# EAGLE design blinkLED (EAGLE 5.11)
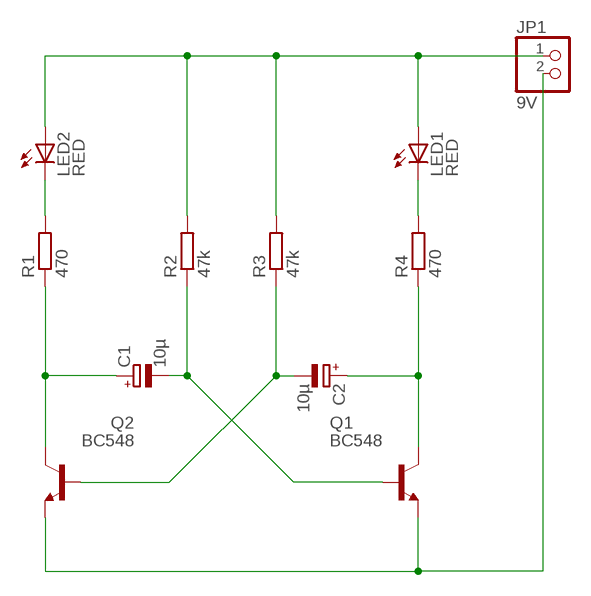
[diagram p0: schematic, sheet 1]

## Parts
C1  10µ  CPOL-EUE2,5-6E  [E2,5-6E]
C2  10µ  CPOL-EUE2,5-6E  [E2,5-6E]
JP1  9V  PINHD-1X2  [1X02]
LED1  RED  LED5MM  [LED5MM]
LED2  RED  LED5MM  [LED5MM]
Q1  BC548  [TO92-EBC]
Q2  BC548  [TO92-EBC]
R1  470  R-EU_0204/5  [0204/5]
R2  47k  R-EU_0204/5  [0204/5]
R3  47k  R-EU_0204/5  [0204/5]
R4  470  R-EU_0204/5  [0204/5]

## Nets
N$1: C2.- Q2.B R3.1
N$2: C1.- Q1.B R2.1
N$3: JP1.2 Q1.E Q2.E
N$4: C1.+ Q2.C R1.1
N$6: C2.+ Q1.C R4.1
N$7: LED2.K(C) R1.2
N$8: LED1.K(C) R4.2
N$10: JP1.1 LED1.A LED2.A R2.2 R3.2

## Library data of the parts
C1 C2 = resistor:CPOL-EU: POLARIZED CAPACITOR, European symbol
JP1 = pinhead:PINHD-1X2: PIN HEADER
LED1 LED2 = led:LED: LED OSRAM: - CHIPLED LG R971, LG N971, LY N971, LG Q971, LY Q971, LO R971, LY R971 LH N974, LH R974 LS Q976, LO Q976, LY Q976 LO Q996 - Hyper CHIPLED LW Q18S LB Q993, LB Q99A, LB R99A - SideLED LS A670, LO A670, LY A670, LG A670, LP A670 LB A673, LV A673, LT A673, LW A673 LH A674 LY A675 LS A676, LA A676, LO A676, LY A676, LW A676 LS A679, LY A679, LG A679 - Hyper Micro SIDELED® LS Y876, LA Y876, LO Y876, LY Y876 LT Y87S - SmartLED LW L88C, LW L88S LB L89C, LB L89S, LG L890 LS L89K, LO L89K, LY L89K LS L896, LA L896, LO L896, LY L896 - TOPLED LS T670, LO T670, LY T670, LG T670, LP T670 LSG T670, LSP T670, LSY T670, LOP T670, LYG T670 LG T671, LOG T671, LSG T671 LB T673, LV T673, LT T673, LW T673 LH T674 LS T676, LA T676, LO T676, LY T676, LB T676, LH T676, LSB T676, LW T676 LB T67C, LV T67C, LT T67C, LS T67K, LO T67K, LY T67K, LW E67C LS E67B, LA E67B, LO E67B, LY E67B, LB E67C, LV E67C, LT E67C LW T67C LS T679, LY T679, LG T679 LS T770, LO T770, LY T770, LG T770, LP T770 LB T773, LV T773, LT T773, LW T773 LH T774 LS E675, LA E675, LY E675, LS T675 LS T776, LA T776, LO T776, LY T776, LB T776 LHGB T686 LT T68C, LB T68C - Hyper Mini TOPLED® LB M676 - Mini TOPLED Santana® LG M470 LS M47K, LO M47K, LY M47K Source: http://www.osram.convergy.de LUXEON: - LUMILED® LXK2-PW12-R00, LXK2-PW12-S00, LXK2-PW14-U00, LXK2-PW14-V00 LXK2-PM12-R00, LXK2-PM12-S00, LXK2-PM14-U00 LXK2-PE12-Q00, LXK2-PE12-R00, LXK2-PE12-S00, LXK2-PE14-T00, LXK2-PE14-U00 LXK2-PB12-K00, LXK2-PB12-L00, LXK2-PB12-M00, LXK2-PB14-N00, LXK2-PB14-P00, LXK2-PB14-Q00 LXK2-PR12-L00, LXK2-PR12-M00, LXK2-PR14-Q00, LXK2-PR14-R00 LXK2-PD12-Q00, LXK2-PD12-R00, LXK2-PD12-S00 LXK2-PH12-R00, LXK2-PH12-S00 LXK2-PL12-P00, LXK2-PL12-Q00, LXK2-PL12-R00 Source: www.luxeon.com KINGBRIGHT: KA-3528ASYC Source: www.kingbright.com
Q1 Q2 = transistor-npn:BC548*: NPN Transistor
R1-R4 = resistor:R-EU_: RESISTOR, European symbol

## Board
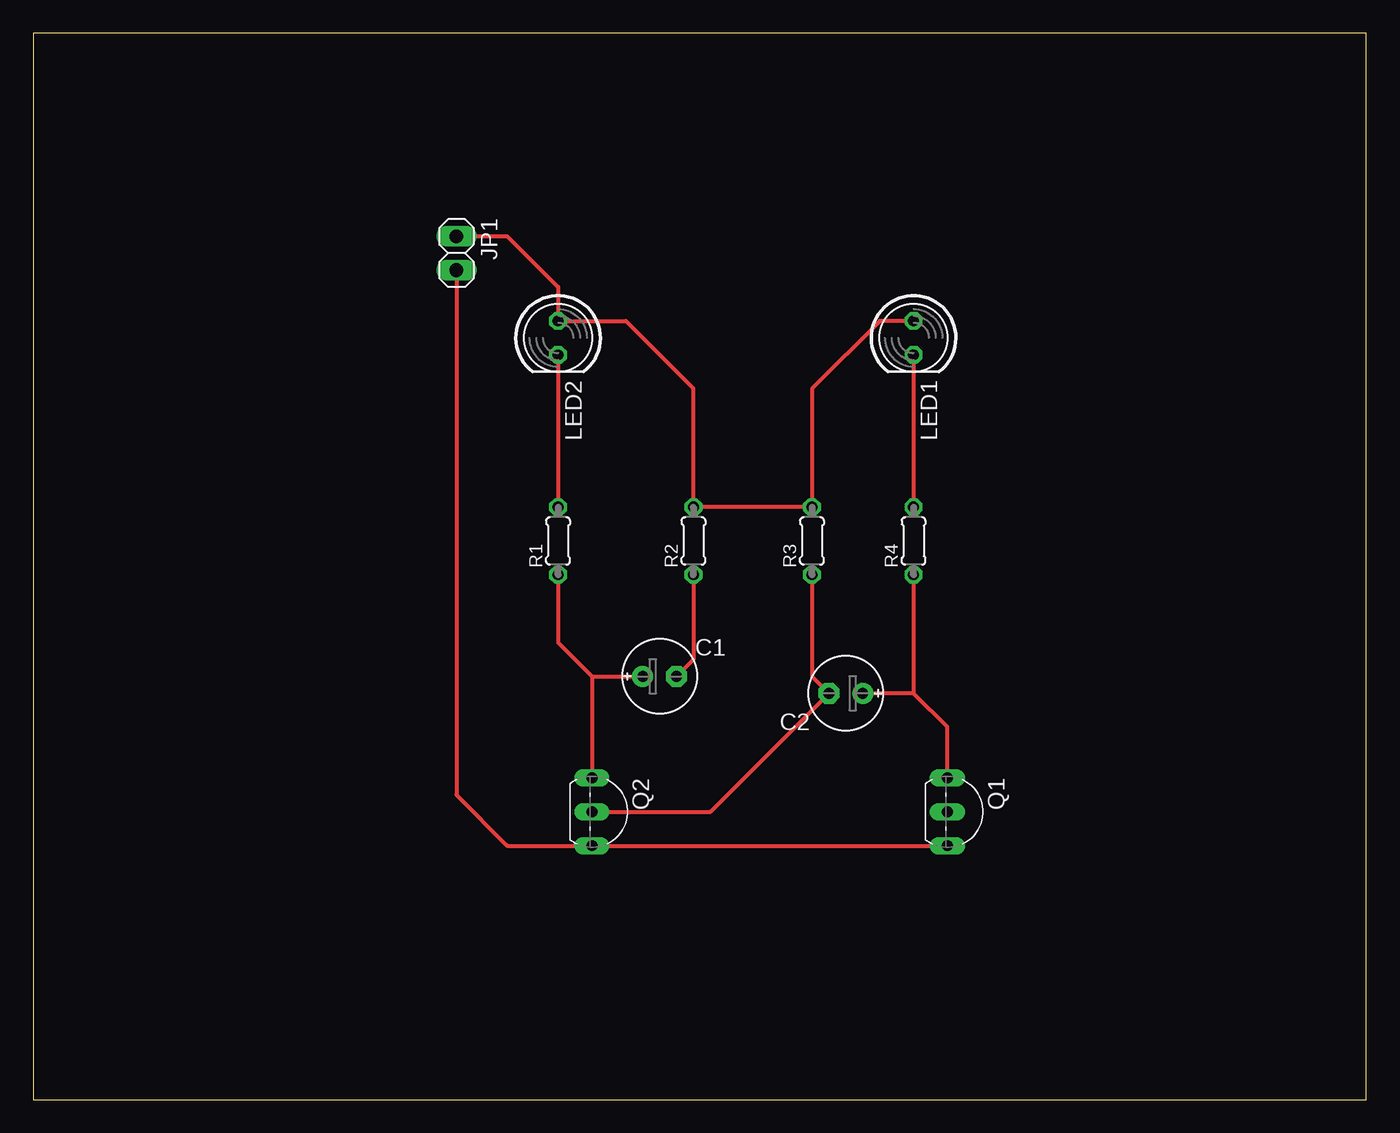
[diagram p1: board, top side]
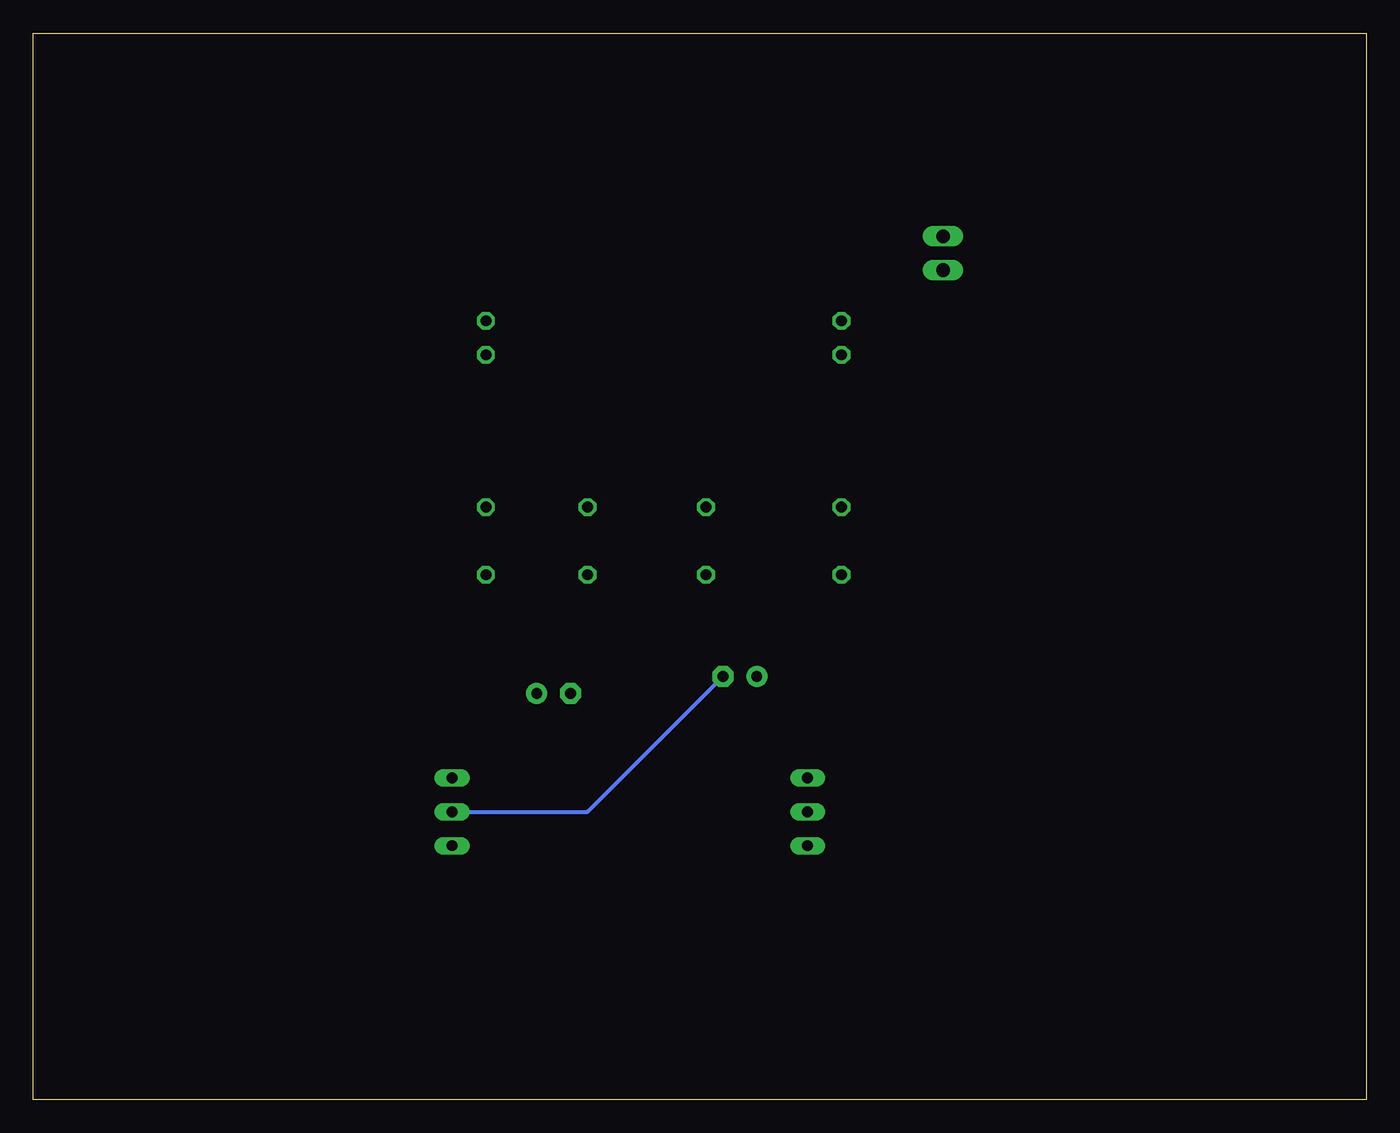
[diagram p2: board, bottom side, seen from below]

Size 100 x 80 mm. Coordinates in mm from the lower left corner, seen from the top.
Outline: 0,0 100,0 100,80 0,80 0,0
Copper layers (1*16): Top 0.035mm / dielectric 1.5mm / Bottom 0.035mm
Design rules "default": minimum track width 6mil, minimum drill 0.35mm, track to track 6mil, track to pad 6mil, pad to pad 6mil, via to via 6mil, smd to smd 6mil, copper to edge 40mil, drill to drill 6mil, minimum pad ring 10mil, minimum via ring 8mil, stop-mask expansion 4mil, vias tented up to drill 0mil, thermal gap 10mil

### Footprints (pad centres in the part's own frame; a part is rotated, then mirrored left to right if it is on the bottom)
E2,5-6E = drill 0.813 pad 1.575: + -1.27,0 | drill 0.813 pad 1.575 octagon: - 1.27,0
1X02 = drill 1.016 long: 1 -1.27,0; 2 1.27,0
LED5MM = drill 0.813 octagon: A -1.27,0; K 1.27,0
TO92-EBC = drill 0.813 long: B 0,-1.27; C -2.54,-1.27; E 2.54,-1.27
0204/5 = drill 0.813 octagon: 1 -2.54,0; 2 2.54,0

### Placement (x,y rotation side)
C1  46.99,31.75 0 top
C2  60.96,30.48 180 top
JP1  31.75,63.5 270 top
LED1  66.04,57.15 270 top
LED2  39.37,57.15 270 top
Q1  69.85,21.59 270 top
Q2  43.18,21.59 270 top
R1  39.37,41.91 90 top
R2  49.53,41.91 90 top
R3  58.42,41.91 90 top
R4  66.04,41.91 90 top

### Tracks (layer width: path | path; a pad name or v marks a point on that pad's centre or on a via)
N$1
  Top 0.305: R3.1 58.42,31.75 C2.- 50.8,21.59 Q2.B
N$2
  Top 0.305: R2.1 49.53,33.02 C1.-
  Bottom 0.305: Q1.B 58.42,21.59 C1.-
N$3
  Top 0.305: JP1.2 31.75,22.86 35.56,19.05 Q2.E Q1.E
N$4
  Top 0.305: 41.91,31.75 C1.+ | 41.91,31.75 Q2.C | R1.1 39.37,34.29 41.91,31.75
N$6
  Top 0.305: Q1.C 68.58,27.94 66.04,30.48 | 66.04,30.48 C2.+ | R4.1 66.04,30.48
N$7
  Top 0.305: LED2.K R1.2
N$8
  Top 0.305: LED1.K R4.2
N$10
  Top 0.305: LED1.A 63.5,58.42 58.42,53.34 R3.2 R2.2 49.53,53.34 44.45,58.42 LED2.A 39.37,60.96 35.56,64.77 JP1.1